# Altium project yaokongqi.PrjPcb
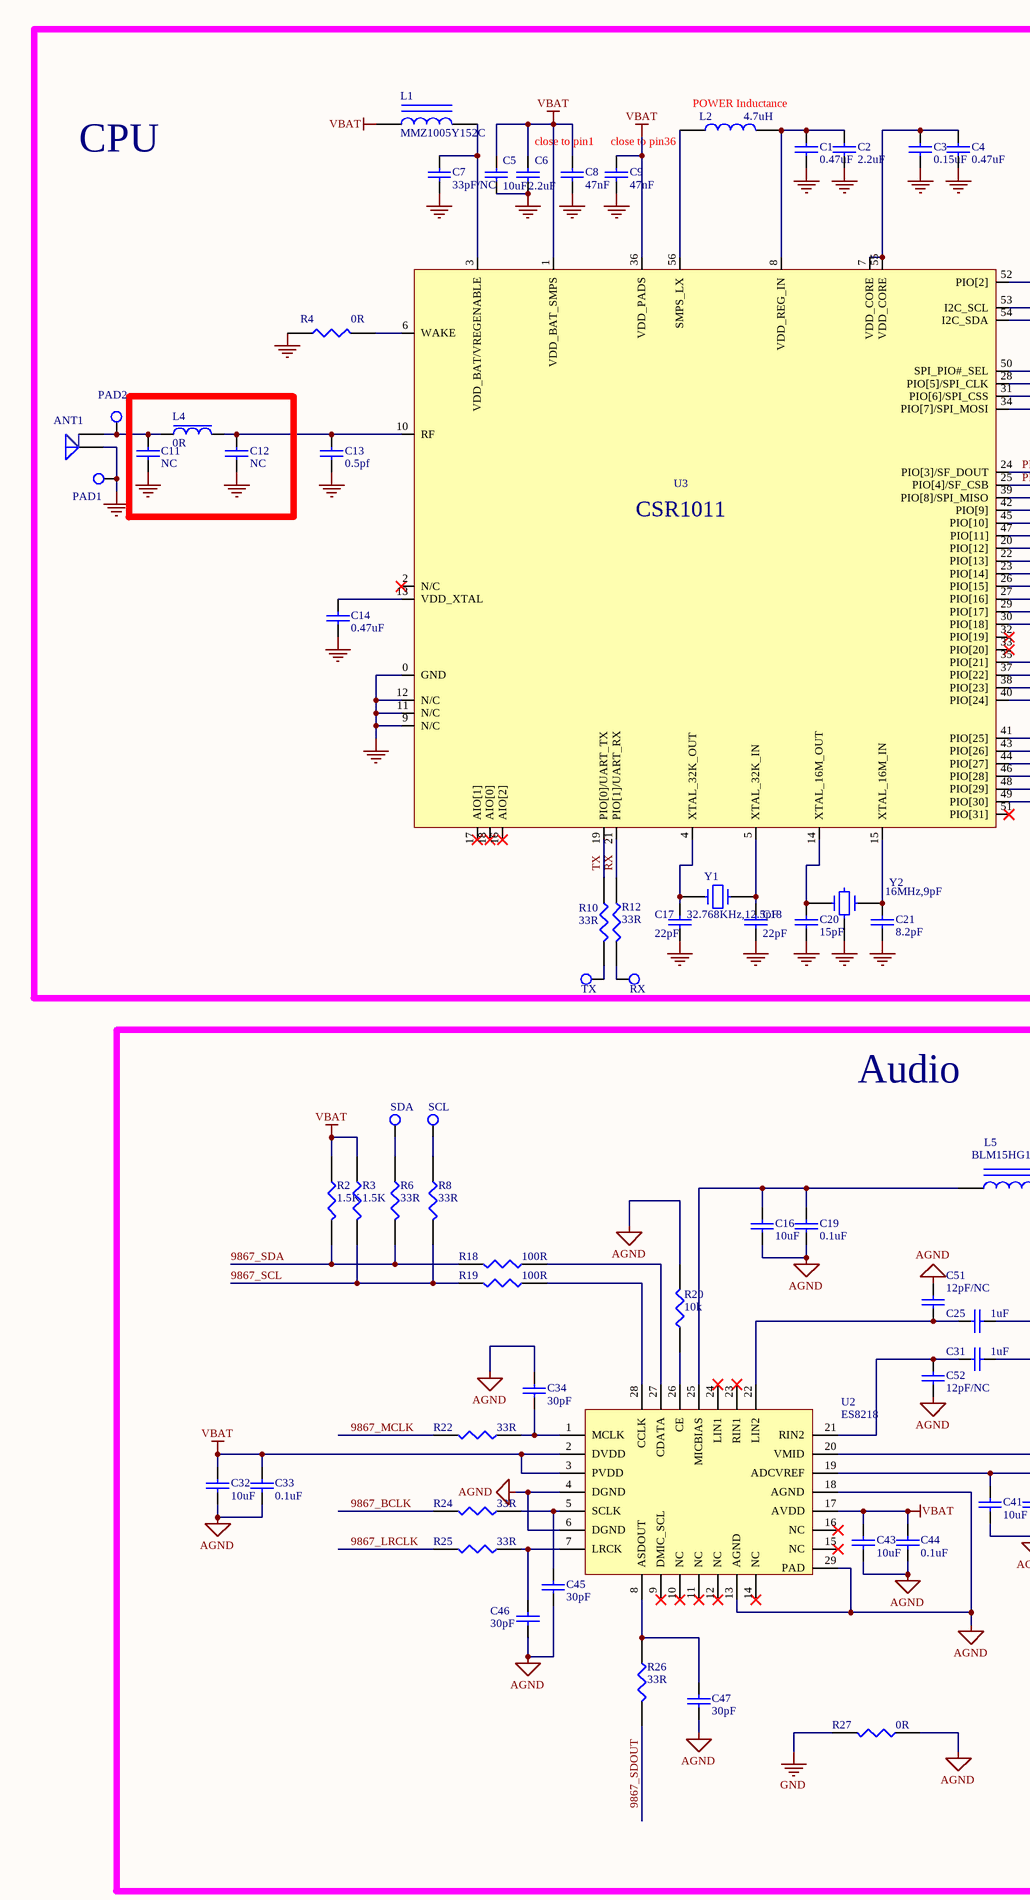
[diagram p0: DSR-0609-ES8218-0410.SchDoc, left]
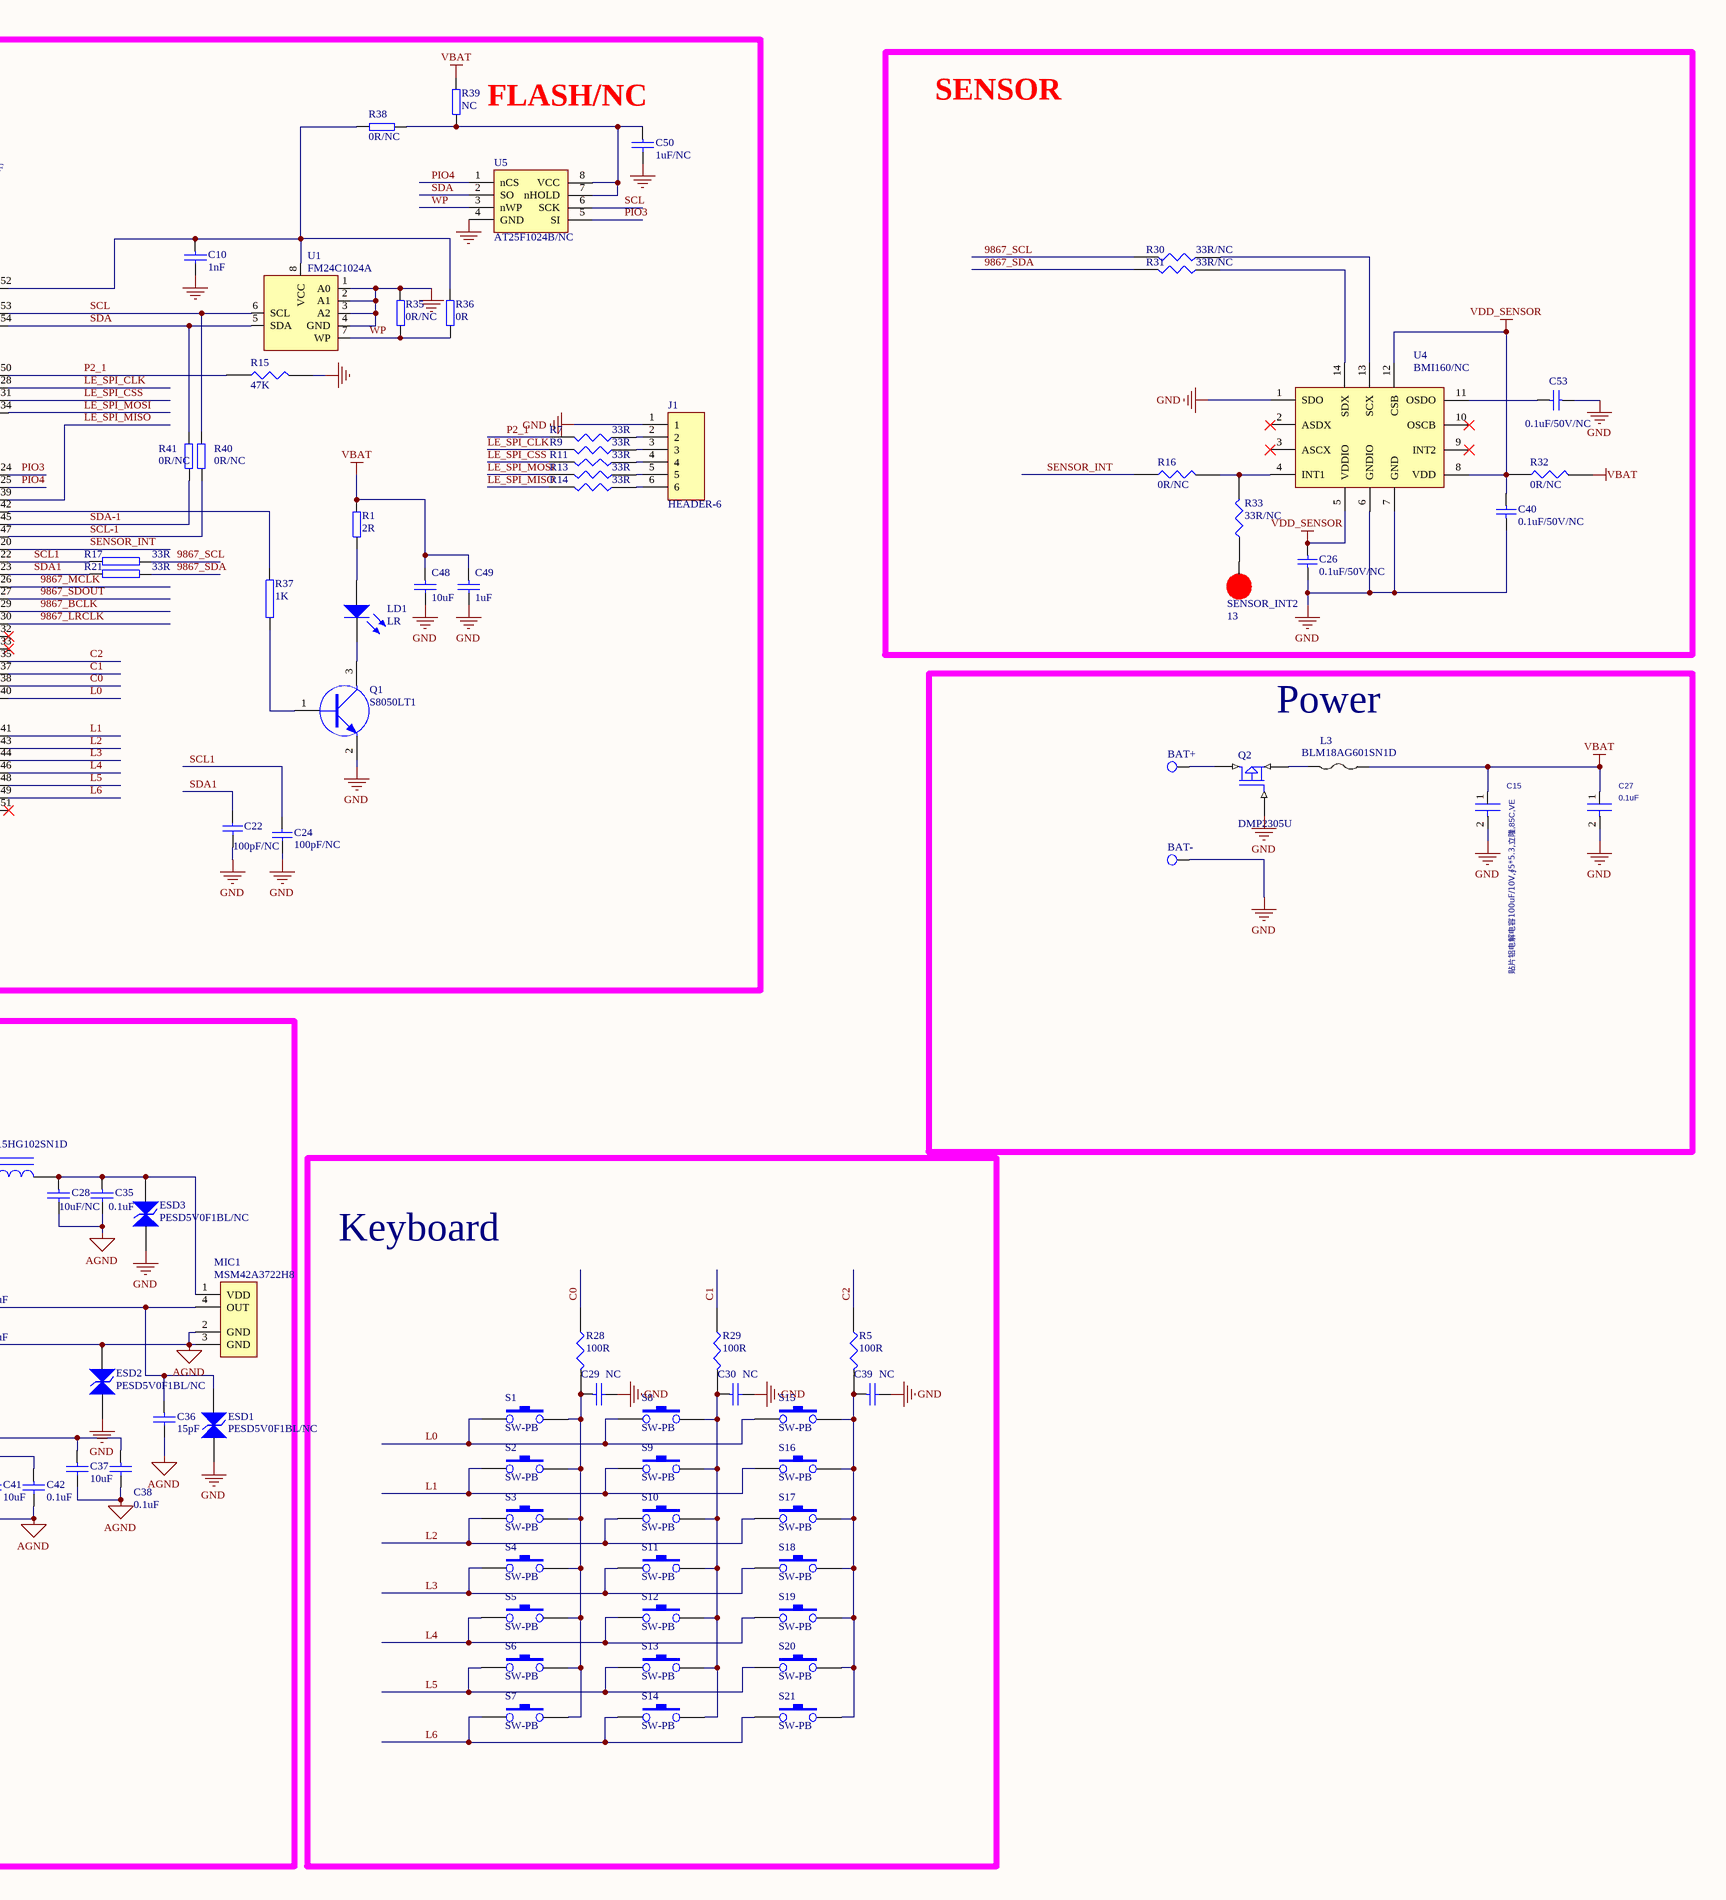
[diagram p1: DSR-0609-ES8218-0410.SchDoc, right]
1 sheet, 142 parts. Net scope: global (net labels, ports and power ports of the same name join across sheets).
Board file: B45120517E.PcbDoc

## Sheet DSR-0609-ES8218-0410.SchDoc
size A2

### Parts
ANT1  ANTENNA  [ACA-2012-A1-CC-S]  (value not drawn)
BAT+  TAP  [BAT]  (value not drawn)
BAT-  TAP  [BAT]  (value not drawn)
C1  0.47uF  [C-0402]
C2  2.2uF  [C-0402]
C3  0.15uF  [C-0402]
C4  0.47uF  [C-0402]
C5  10uF  [C-0603]
C6  2.2uF  [C-0402]
C7  33pF/NC  [C-0402]
C8  47nF  [C-0402]
C9  47nF  [C-0402]
C10  1nF  [C-0402]
C11  NC  [C-0402]
C12  NC  [C-0402]
C13  0.5pf  [C-0402]
C14  0.47uF  [C-0402]
C15  贴片铝电解电容100uF/10V,∮5*5.3,立隆,85C,VE  [CAP_ALUM-C]
C16  10uF  [C-0603]
C17  22pF  [C-0402]
C18  22pF  [C-0402]
C19  0.1uF  [C-0402]
C20  15pF  [C-0402]
C21  8.2pF  [C-0402]
C22  100pF/NC  [C-0402]
C24  100pF/NC  [C-0402]
C25  1uF  [C-0402]
C26  0.1uF/50V/NC  [C-0402]
C27  0.1uF  [C-0603]
C28  10uF/NC  [C-0603]
C29  NC  [C-0402]
C30  NC  [C-0402]
C31  1uF  [C-0402]
C32  10uF  [C-0603]
C33  0.1uF  [C-0402]
C34  30pF  [C-0402]
C35  0.1uF  [C-0402]
C36  15pF  [C-0402]
C37  10uF  [C-0603]
C38  0.1uF  [C-0402]
C39  NC  [C-0402]
C40  0.1uF/50V/NC  [C-0402]
C41  10uF  [C-0603]
C42  0.1uF  [C-0402]
C43  10uF  [C-0603]
C44  0.1uF  [C-0402]
C45  30pF  [C-0402]
C46  30pF  [C-0402]
C47  30pF  [C-0402]
C48  10uF  [C-0603]
C49  1uF  [C-0603]
C50  1uF/NC  [C-0402]
C51  12pF/NC  [C-0402]
C52  12pF/NC  [C-0402]
C53  0.1uF/50V/NC  [C-0402]
ESD1  PESD5V0F1BL/NC  [SOD882]
ESD2  PESD5V0F1BL/NC  [SOD882]
ESD3  PESD5V0F1BL/NC  [SOD882]
J1  HEADER-6  [PH-1*6-2.0]
L1  MMZ1005Y152C  [R-0402]
L2  4.7uH  [R-1008]
L3  BLM18AG601SN1D  [R-0603]
L4  0R  [R-0402]
L5  BLM15HG102SN1D  [R-0402]
LD1  LR  [IR-4.2-3]
MIC1  MSM42A3722H8  [MSM42A3722H8]
PAD1  TAP  [TS-1.0]  (value not drawn)
PAD2  TAP  [TS-1.0]  (value not drawn)
Q1  S8050LT1  [SOT-23]
Q2  DMP2305U  [SOT-23]
R1  2R  [R-0805]
R2  1.5K  [R-0402]
R3  1.5K  [R-0402]
R4  0R  [R-0402]
R5  100R  [R-0402]
R6  33R  [R-0402]
R7  33R  [R-0402]
R8  33R  [R-0402]
R9  33R  [R-0402]
R10  33R  [R-0402]
R11  33R  [R-0402]
R12  33R  [R-0402]
R13  33R  [R-0402]
R14  33R  [R-0402]
R15  47K  [R-0402]
R16  0R/NC  [R-0402]
R17  33R  [R-0402]
R18  100R  [R-0402]
R19  100R  [R-0402]
R20  10k  [R-0402]
R21  33R  [R-0402]
R22  33R  [R-0402]
R24  33R  [R-0402]
R25  33R  [R-0402]
R26  33R  [R-0402]
R27  0R  [R-0603]
R28  100R  [R-0402]
R29  100R  [R-0402]
R30  33R/NC  [R-0402]
R31  33R/NC  [R-0402]
R32  0R/NC  [R-0402]
R33  33R/NC  [R-0402]
R35  0R/NC  [R-0402]
R36  0R  [R-0402]
R37  1K  [R-0402]
R38  0R/NC  [R-0402]
R39  NC  [R-0402]
R40  0R/NC  [R-0402]
R41  0R/NC  [R-0402]
RX  TAP  [TS-1.0]  (value not drawn)
S1  SW-PB  [K mat D5]
S2  SW-PB  [K mat D5]
S3  SW-PB  [K mat D5]
S4  SW-PB  [K mat D5]
S5  SW-PB  [K mat D5]
S6  SW-PB  [K mat D5]
S7  SW-PB  [K mat D5]
S8  SW-PB  [K mat D5]
S9  SW-PB  [K mat D5]
S10  SW-PB  [K mat D5]
S11  SW-PB  [K mat D5]
S12  SW-PB  [K mat D5]
S13  SW-PB  [K mat D5]
S14  SW-PB  [K mat D5]
S15  SW-PB  [KG4.5*4.5-SMD-1]
S16  SW-PB  [K mat D5]
S17  SW-PB  [K mat D5]
S18  SW-PB  [K mat D5]
S19  SW-PB  [K mat D5]
S20  SW-PB  [K mat D5]
S21  SW-PB  [K mat D5]
SCL  TAP  [TS-1.0]  (value not drawn)
SDA  TAP  [TS-1.0]  (value not drawn)
SENSOR_INT2  13  [TS-1.0]
TX  TAP  [TS-1.0]  (value not drawn)
U1  FM24C1024A  [SOP08-6.0-1.27]
U2  ES8218
U3  CSR1011  [QFN-56-8*8]
U4  BMI160/NC  [LGA-14]
U5  AT25F1024B/NC  [SOP08-6.0-1.27]
Y1  32.768KHz,12.5pF  [32.768Khz-3215]
Y2  16MHz,9pF  [XD3225-1-12M-125M]

### Blocks framed on the sheet
CPU: ANT1 C1-C14 C17 C18 C20-C22 C24 C48-C50 J1 L1 L2 L4 LD1 PAD1 PAD2 Q1 R1 R4 R7 R9-R15 R17 R21 R35-R41 RX TX U1 U3 U5 Y1 Y2
SENSOR: C26 C40 C53 R16 R30-R33 SENSOR_INT2 U4
Power: BAT+ BAT- C15 C27 L3 Q2
Audio: C16 C19 C25 C28 C31-C38 C41-C47 C51 C52 ESD1-ESD3 L5 MIC1 R2 R3 R6 R8 R18-R20 R22 R24-R27 SCL SDA U2
Keyboard: C29 C30 C39 R5 R28 R29 S1-S21

### Nets
AGND: C16.2 C19.2 C28.2 C31.1 C32.2 C33.2 C34.1 C35.2 C36.2 C37.2 C38.2 C41.2 C42.2 C43.2 C44.2 C45.2 C46.2 C47.2 C51.1 C52.2 ESD2.1 MIC1.2(GND) MIC1.3(GND) R20.2 R27.1 U2.4(DGND) U2.6(DGND) U2.13(AGND) U2.18(AGND) U2.29(PAD)
GND: ANT1.1(A) BAT-.1 C1.2 C2.2 C3.2 C4.2 C5.2 C6.2 C7.2 C8.2 C9.2 C10.2 C11.2 C12.2 C13.2 C14.2 C15.2 C17.2 C18.2 C20.2 C21.2 C22.1 C24.1 C26.2 C27.2 C29.2 C30.2 C39.2 C40.2 C48.2 C49.2 C50.2 C53.2 ESD1.2 ESD2.2 ESD3.2 J1.1 PAD1.1 Q1.2 Q2.2 R4.1 R15.2 R27.2 R35.1 U1.1(A0) U1.2(A1) U1.3(A2) U1.4(GND) U3.0(GND) U3.9(N/C) U3.11(N/C) U3.12(N/C) U4.1(SDO) U4.6(GNDIO) U4.7(GND) U5.4(GND) Y2.3
VBAT: C5.1 C6.1 C8.1 C9.1 C15.1 C27.1 C32.1 C33.1 C43.1 C44.1 C48.1 C49.1 L1.1 L3.1 R1.2 R2.1 R3.1 R32.2 R39.2 U2.2(DVDD) U2.3(PVDD) U2.17(AVDD) U3.1(VDD_BAT_SMPS) U3.36(VDD_PADS)
VDD_SENSOR: C26.1 C40.1 R32.1 U4.5(VDDIO) U4.8(VDD) U4.12(CSB)
9867_BCLK: R24.2 U3.29(PIO[17])
9867_LRCLK: R25.2 U3.30(PIO[18])
9867_MCLK: R22.2 U3.26(PIO[15])
9867_SCL: R3.2 R8.2 R17.1 R19.2 R30.2
9867_SDA: R2.2 R6.2 R18.2 R21.1 R31.2
9867_SDOUT: R26.2 U3.27(PIO[16])
C0: R28.1 U3.38(PIO[23])
C1: R29.1 U3.37(PIO[22])
C2: R5.1 U3.35(PIO[21])
L0: S1.1 S8.1 S15.1 U3.40(PIO[24])
L1: S2.1 S9.1 S16.1 U3.41(PIO[25])
L2: S3.1 S10.1 S17.1 U3.43(PIO[26])
L3: S4.1 S11.1 S18.1 U3.44(PIO[27])
L4: S5.1 S12.1 S19.1 U3.46(PIO[28])
L5: S6.1 S13.1 S20.1 U3.48(PIO[29])
L6: S7.1 S14.1 S21.1 U3.49(PIO[30])
LE_SPI_CLK: R9.2 U3.28(PIO[5]/SPI_CLK)
LE_SPI_CSS: R11.2 U3.31(PIO[6]/SPI_CSS)
LE_SPI_MISO: R14.2 U3.39(PIO[8]/SPI_MISO)
LE_SPI_MOSI: R13.2 U3.34(PIO[7]/SPI_MOSI)
P2_1: R7.2 R15.1 U3.50(SPI_PIO#_SEL)
PIO3: U3.24(PIO[3]/SF_DOUT) U5.5(SI)
PIO4: U3.25(PIO[4]/SF_CSB) U5.1(nCS)
RX: R12.1 U3.21(PIO[1]/UART_RX)
SCL: R40.2 U1.6(SCL) U3.53(I2C_SCL) U5.6(SCK)
SCL1: C24.2 R17.2 U3.22(PIO[13])
SCL-1: R40.1 U3.47(PIO[11])
SDA: R41.2 U1.5(SDA) U3.54(I2C_SDA) U5.2(SO)
SDA1: C22.2 R21.2 U3.23(PIO[14])
SDA-1: R41.1 U3.45(PIO[10])
SENSOR_INT: R16.1 U3.20(PIO[12])
TX: R10.1 U3.19(PIO[0]/UART_TX)
WP: R35.2 R36.2 U1.7(WP) U5.3(nWP)
NetANT1_2: ANT1.2 C11.1 L4.1 PAD2.1
NetBAT+_1: BAT+.1 Q2.3
NetC1_1: C1.1 C2.1 L2.2 U3.8(VDD_REG_IN)
NetC3_1: C3.1 C4.1 U3.7(VDD_CORE) U3.55(VDD_CORE)
NetC7_1: C7.1 L1.2 U3.3(VDD_BAT/VREGENABLE)
NetC10_1: C10.1 R36.1 R38.1 U1.8(VCC) U3.52(PIO[2])
NetC12_1: C12.1 C13.1 L4.2 U3.10(RF)
NetC14_1: C14.1 U3.13(VDD_XTAL)
NetC16_1: C16.1 C19.1 L5.1 U2.25(MICBIAS)
NetC17_1: C17.1 U3.4(XTAL_32K_OUT) Y1.1
NetC18_1: C18.1 U3.5(XTAL_32K_IN) Y1.2
NetC20_1: C20.1 U3.14(XTAL_16M_OUT) Y2.1
NetC21_1: C21.1 U3.15(XTAL_16M_IN) Y2.2
NetC25_1: C25.1 C36.1 ESD1.1 MIC1.4(OUT)
NetC25_2: C25.2 C51.2 U2.22(LIN2)
NetC28_1: C28.1 C35.1 ESD3.1 L5.2 MIC1.1(VDD)
NetC29_1: C29.1 R28.2 S1.2 S2.2 S3.2 S4.2 S5.2 S6.2 S7.2
NetC30_1: C30.1 R29.2 S8.2 S9.2 S10.2 S11.2 S12.2 S13.2 S14.2
NetC31_2: C31.2 C52.1 U2.21(RIN2)
NetC34_2: C34.2 R22.1 U2.1(MCLK)
NetC37_1: C37.1 C38.1 U2.20(VMID)
NetC39_1: C39.1 R5.2 S15.2 S16.2 S17.2 S18.2 S19.2 S20.2 S21.2
NetC41_1: C41.1 C42.1 U2.19(ADCVREF)
NetC45_1: C45.1 R24.1 U2.5(SCLK)
NetC46_1: C46.1 R25.1 U2.7(LRCK)
NetC47_1: C47.1 R26.1 U2.8(ASDOUT)
NetC50_1: C50.1 R38.2 R39.1 U5.7(nHOLD) U5.8(VCC)
NetC53_1: C53.1 U4.11(OSDO)
NetJ1_2: J1.2 R7.1
NetJ1_3: J1.3 R9.1
NetJ1_4: J1.4 R11.1
NetJ1_5: J1.5 R13.1
NetJ1_6: J1.6 R14.1
NetL2_1: L2.1 U3.56(SMPS_LX)
NetL3_2: L3.2 Q2.1
NetLD1_1: LD1.1 R1.1
NetLD1_2: LD1.2 Q1.3
NetQ1_1: Q1.1 R37.1
NetR4_2: R4.2 U3.6(WAKE)
NetR6_1: R6.1 SDA.1
NetR8_1: R8.1 SCL.1
NetR10_2: R10.2 TX.1
NetR12_2: R12.2 RX.1
NetR16_2: R16.2 R33.2 U4.4(INT1)
NetR18_1: R18.1 U2.27(CDATA)
NetR19_1: R19.1 U2.28(CCLK)
NetR20_1: R20.1 U2.26(CE)
NetR30_1: R30.1 U4.13(SCX)
NetR31_1: R31.1 U4.14(SDX)
NetR33_1: R33.1 SENSOR_INT2.1
NetR37_2: R37.2 U3.42(PIO[9])

Not connected (* = marked no-connect by the designer): U2 9(DMIC_SCL)* 10(NC)* 11(NC)* 12(NC)* 14(NC)* 15(NC)* 16(NC)* 23(RIN1)* 24(LIN1)*; U3 2(N/C)* 16(AIO[2])* 17(AIO[1])* 18(AIO[0])* 32(PIO[19])* 33(PIO[20])* 51(PIO[31])*; U4 2(ASDX)* 3(ASCX)* 9(INT2)* 10(OSCB)*

### Notes on the sheet
- FLASH/NC
- close to pin1
- close to pin36
- (near L2) POWER Inductance

### Library data of the parts
C1-C14 C16-C21 C25 C28-C39 C41-C52 = CAP: Capacitor
C15 C27 = C_Dup1
C22 C24 = CAP
C26 C40 C53 = Cap: capacitor 27 pF NPO , +/- 2 %, SMD case 0603; Manufacturer: Generic Components; Class: Passive; Value: 27pF; Published: 08/06/2000; Publisher: Altium Hobart Technology Centre; SubClass: Capacitor
ESD1-ESD3 = ESD
L1 L5 = INDUCTOR IRON
L2 L4 = INDUCTOR
L3 = Inductance
LD1 = LED
Q1 = NPN: NPN型晶体管
Q2 = MOSFET P
R1 R17 R21 R35-R41 = RES
R2-R16 R18-R20 R22 R24-R33 = RES1
SENSOR_INT2 = TESTPOINT
U1 = AT24C512
U3 = CSR1001
U4 = BMI160
U5 = AT25F512B
Y1 = CRYSTAL2
Y2 = CRYSTAL4